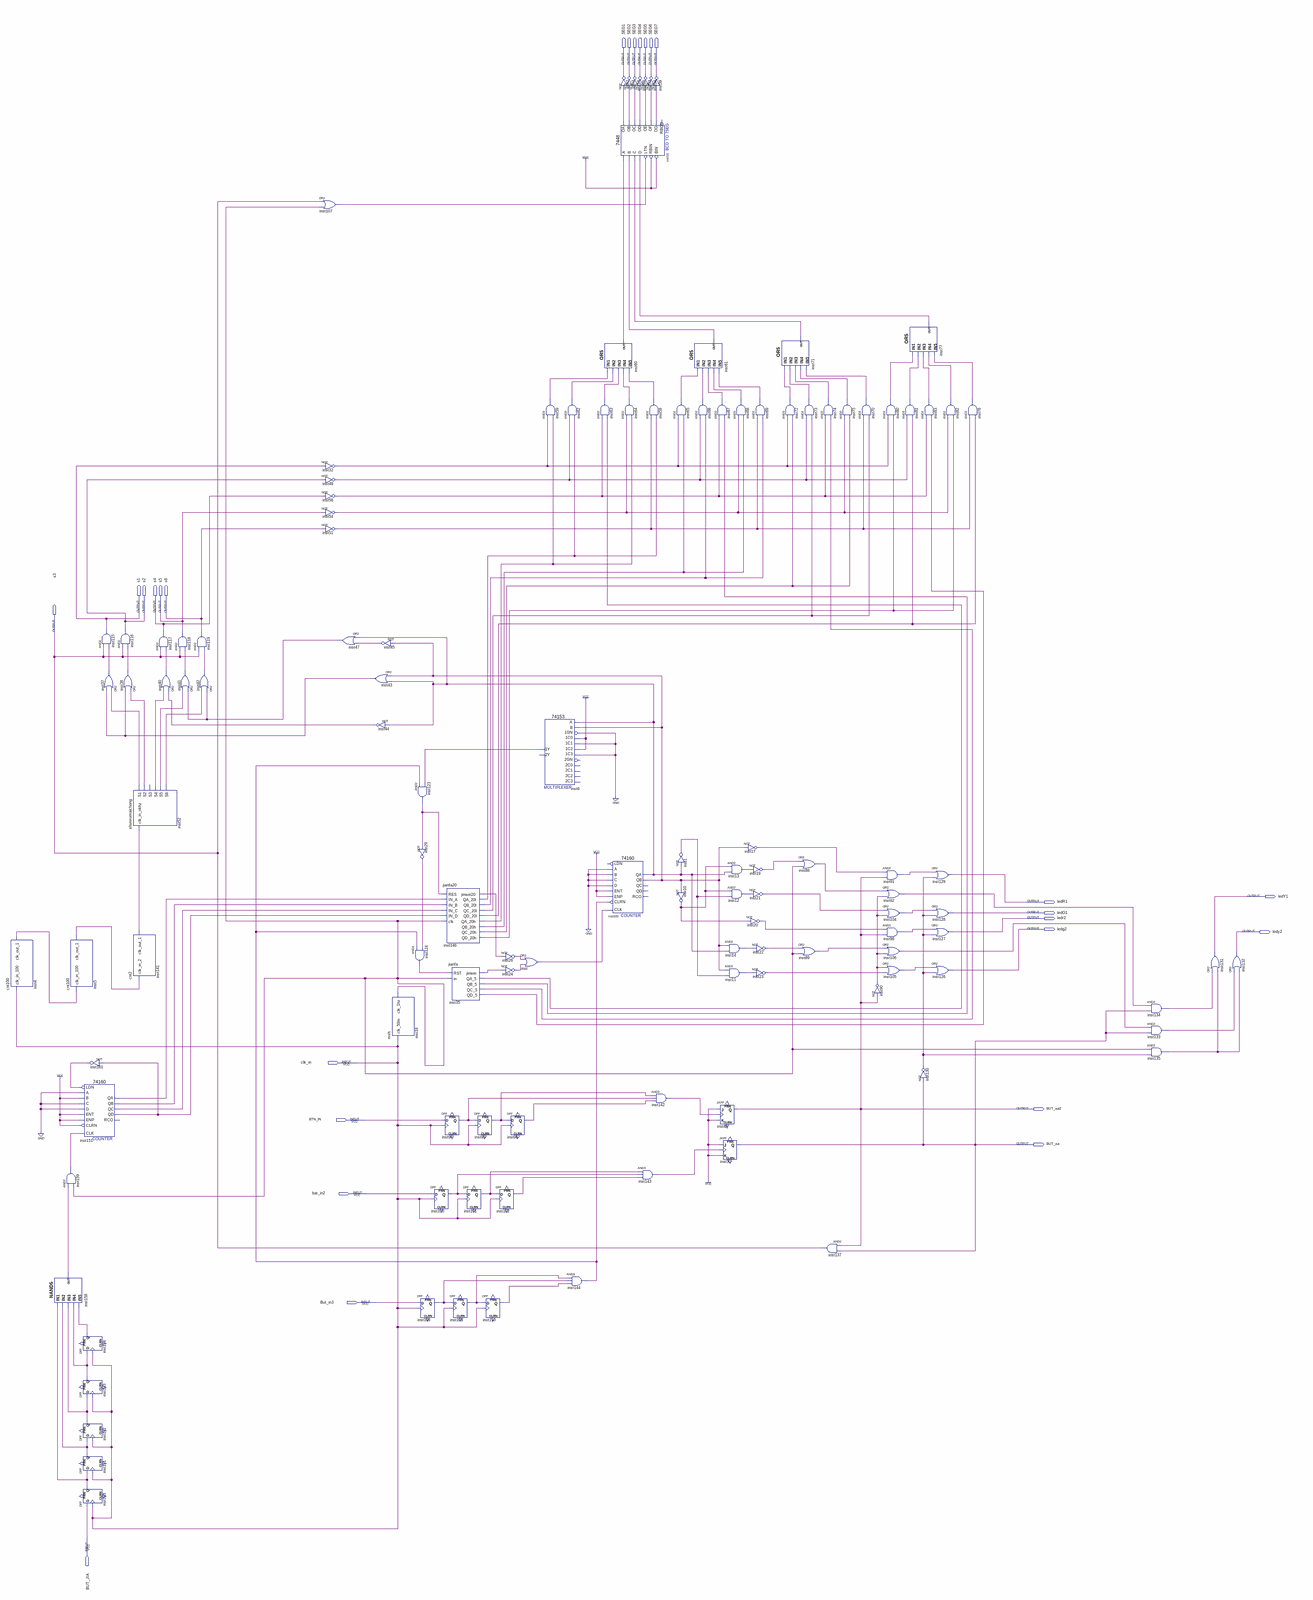
[diagram p0: schematic sheet, whole]
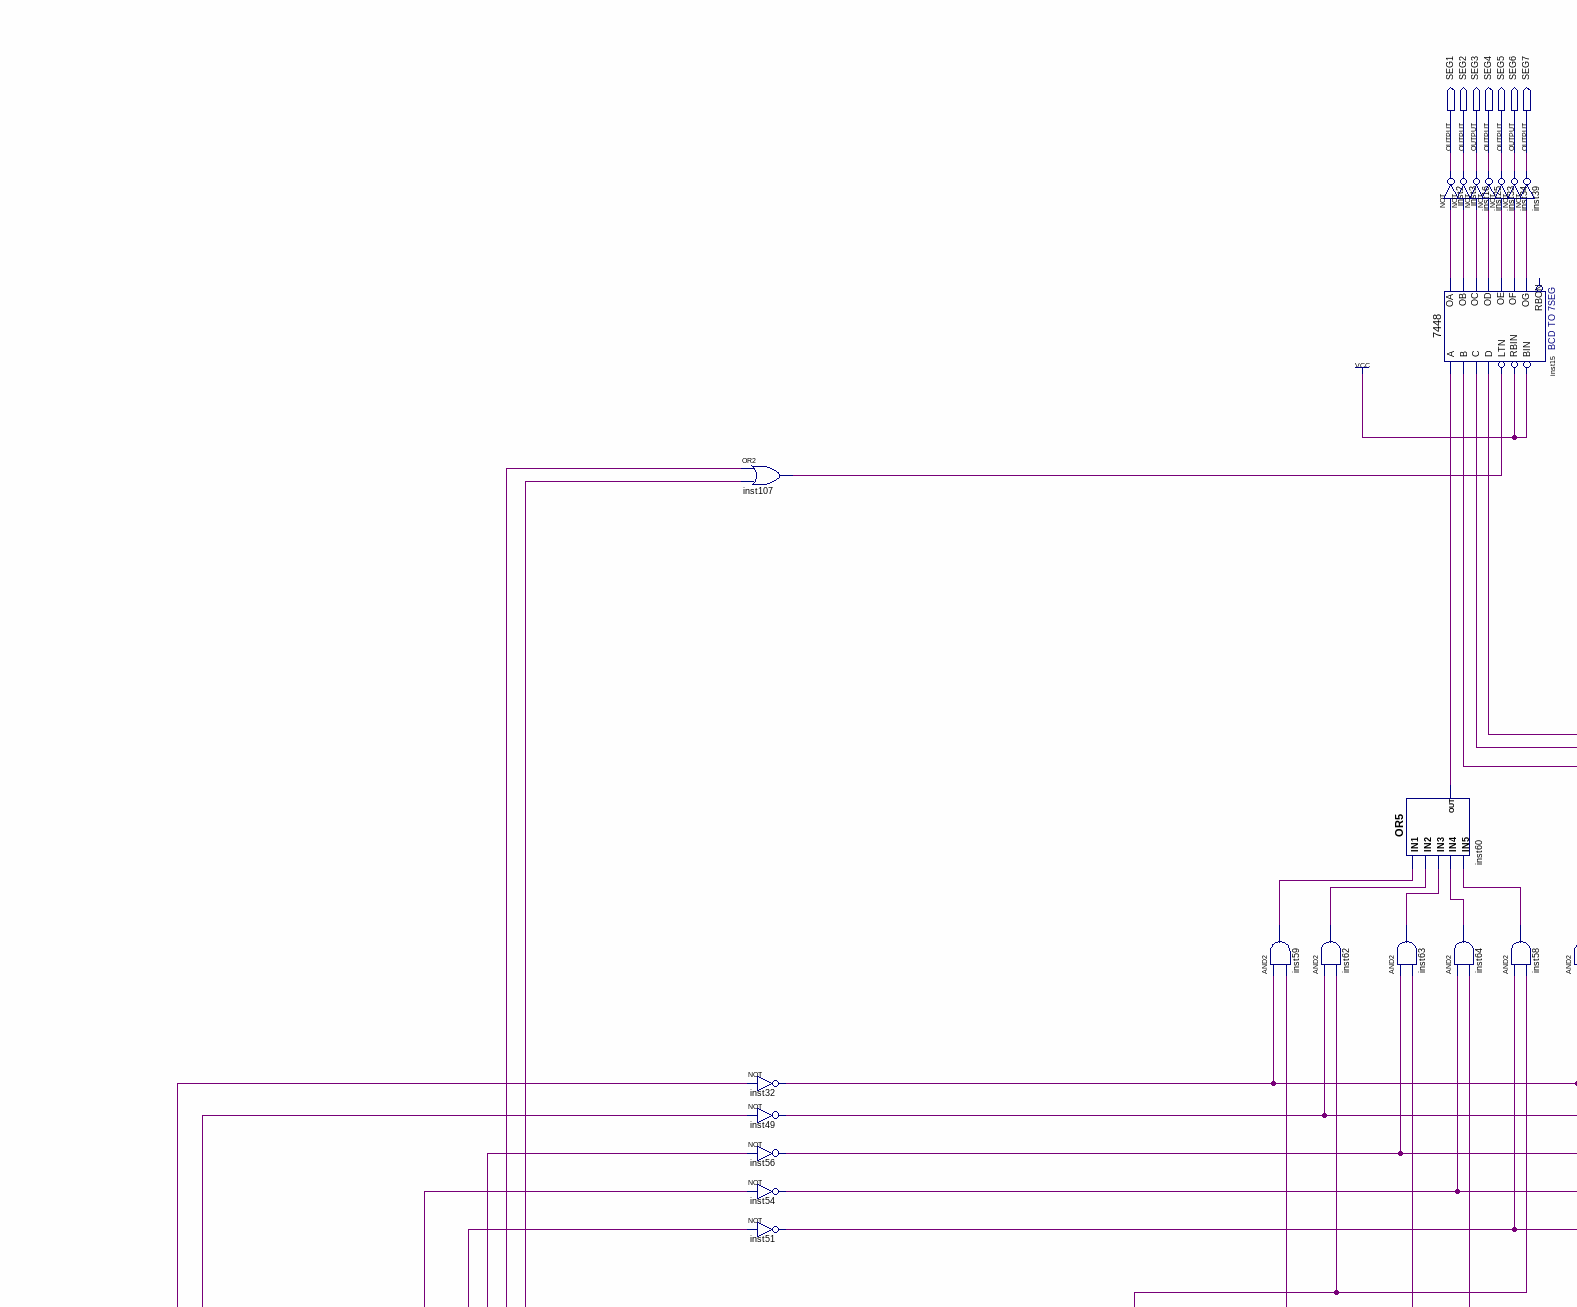
[diagram p1: schematic sheet, upper left part]
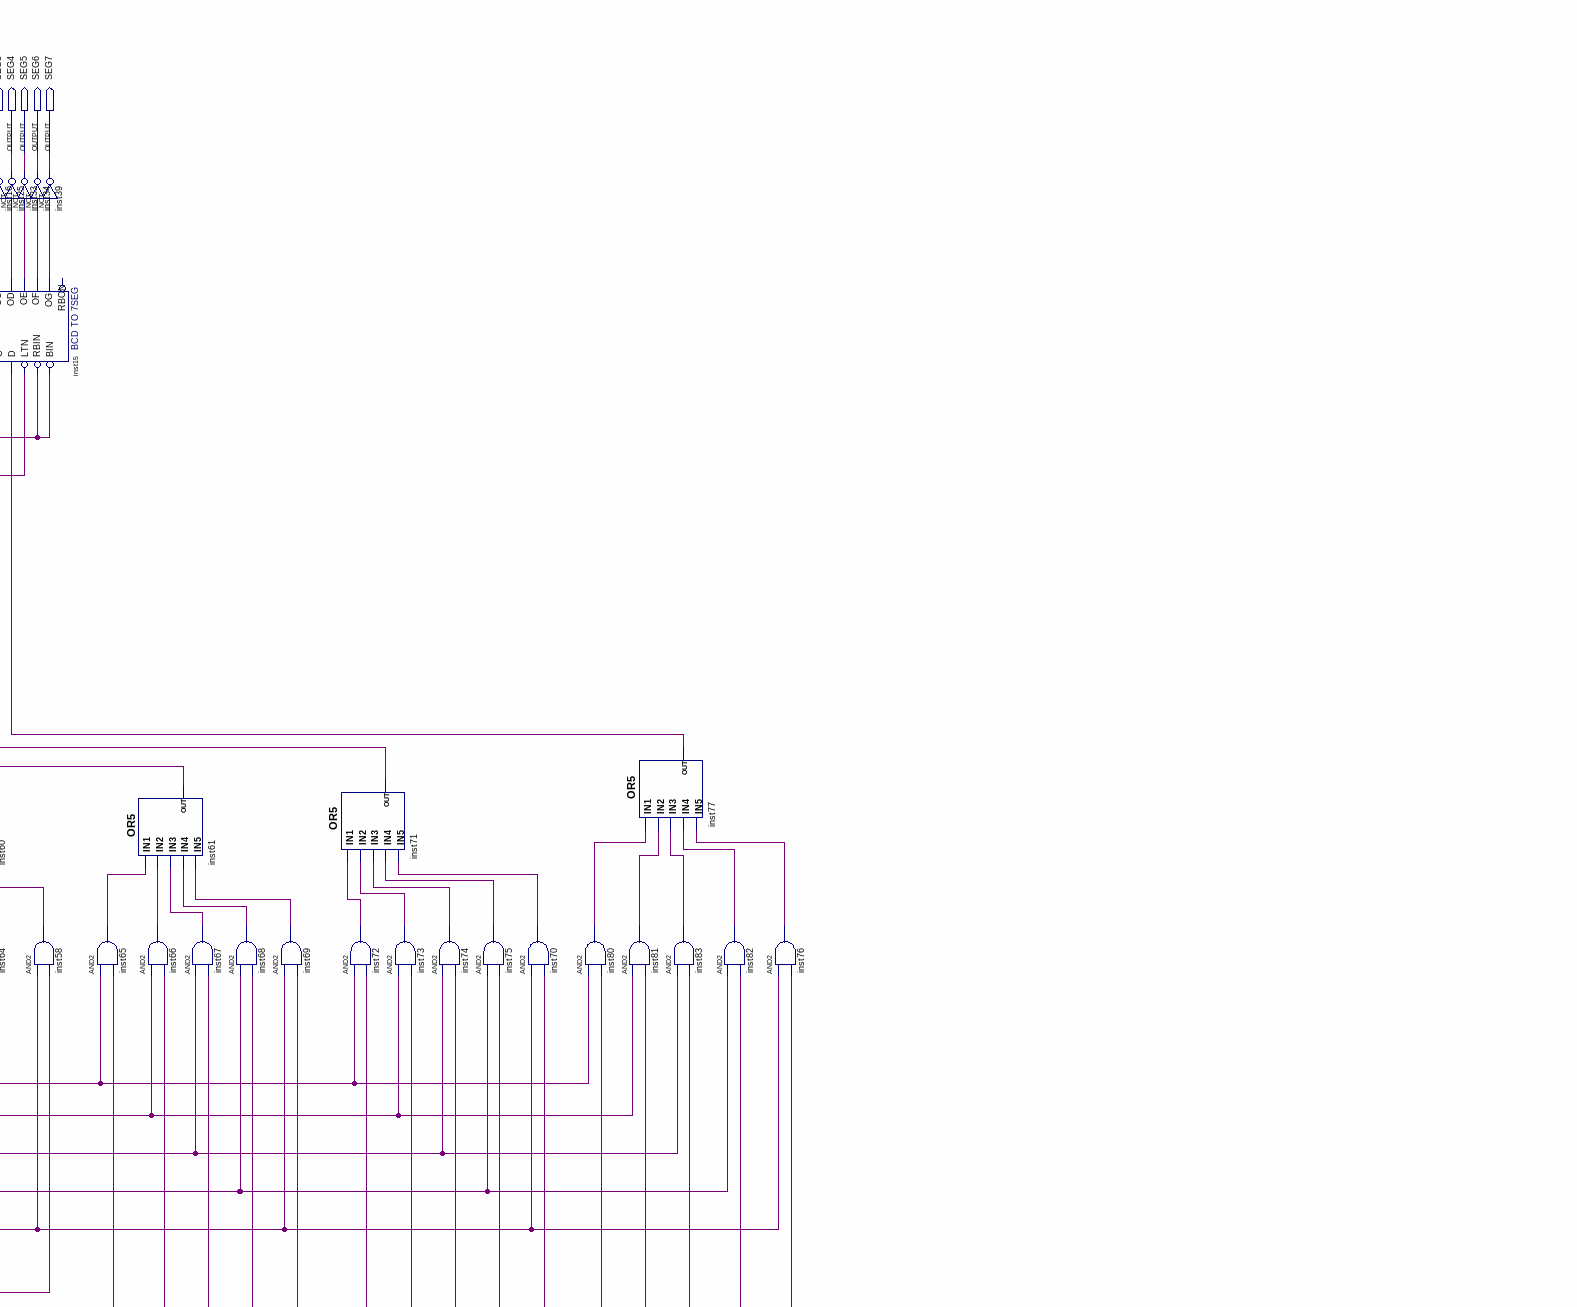
[diagram p2: schematic sheet, upper right part]
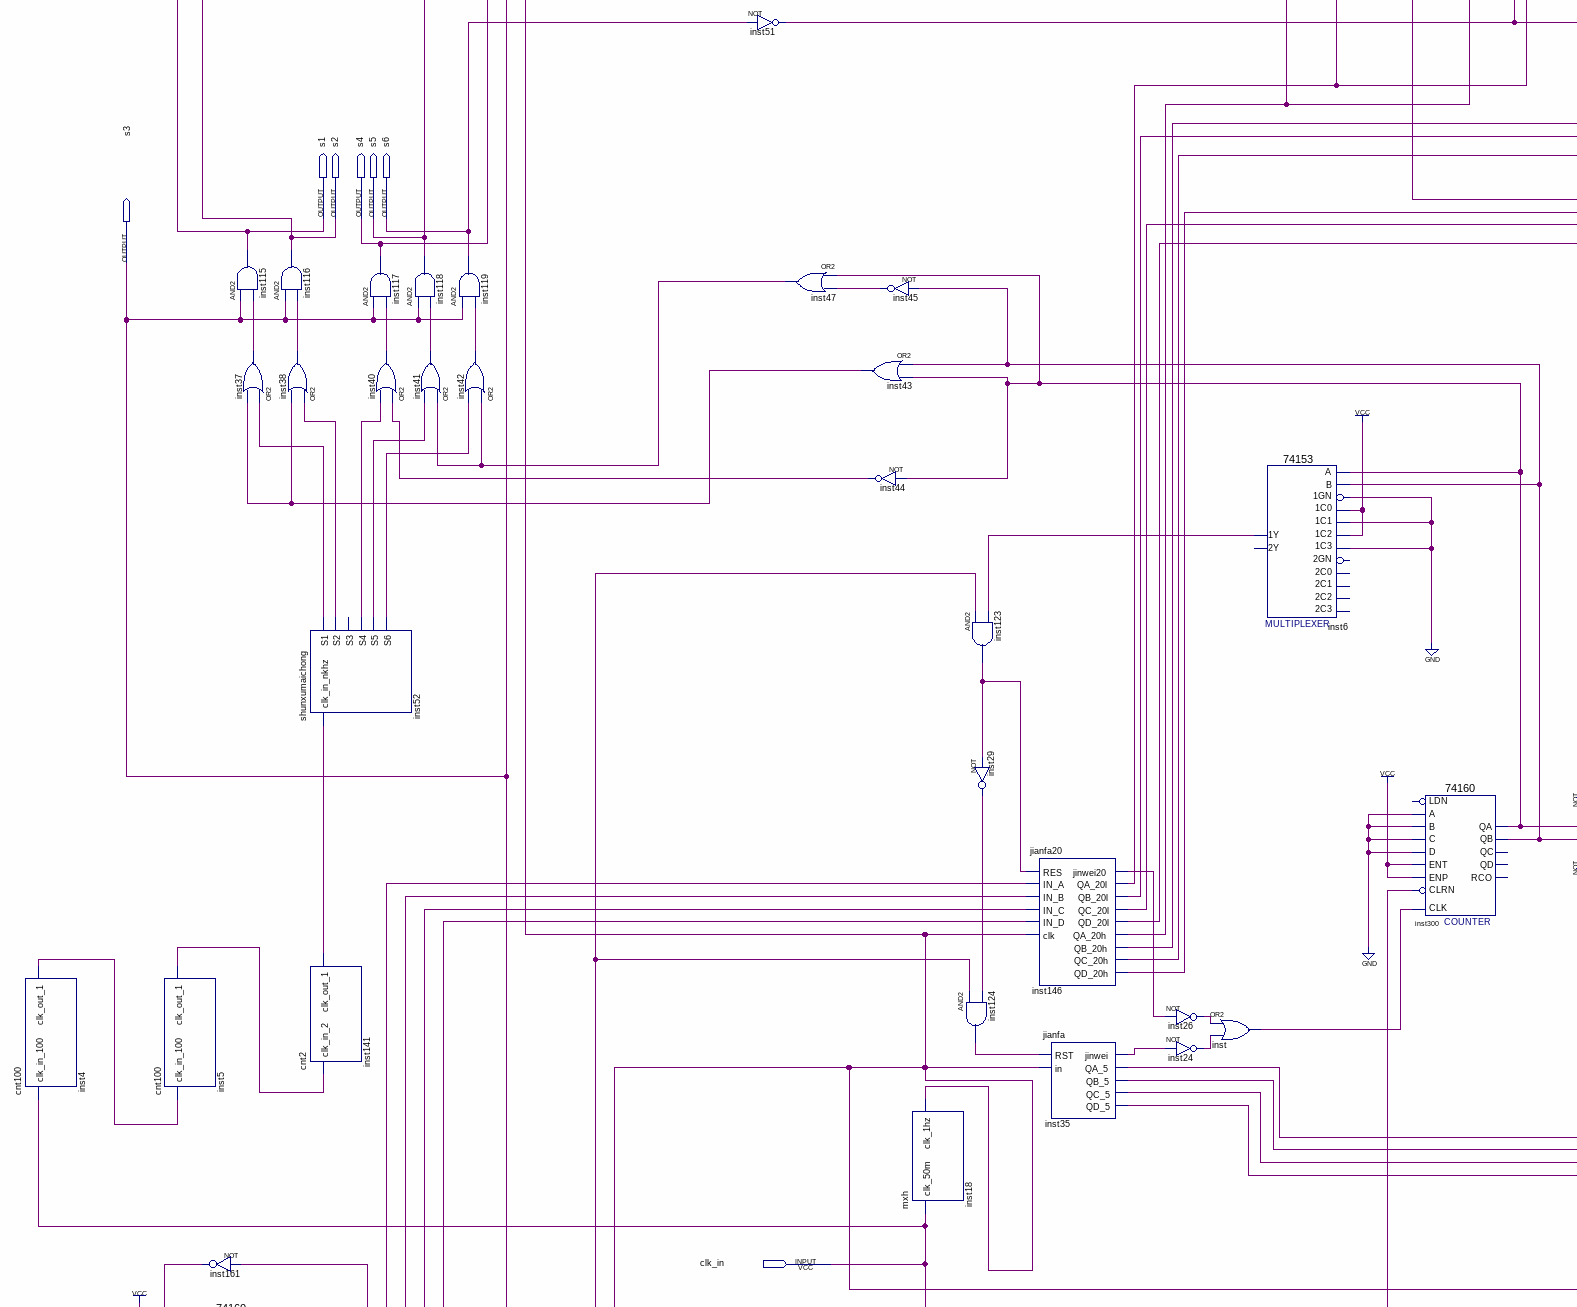
[diagram p3: schematic sheet, middle left part]
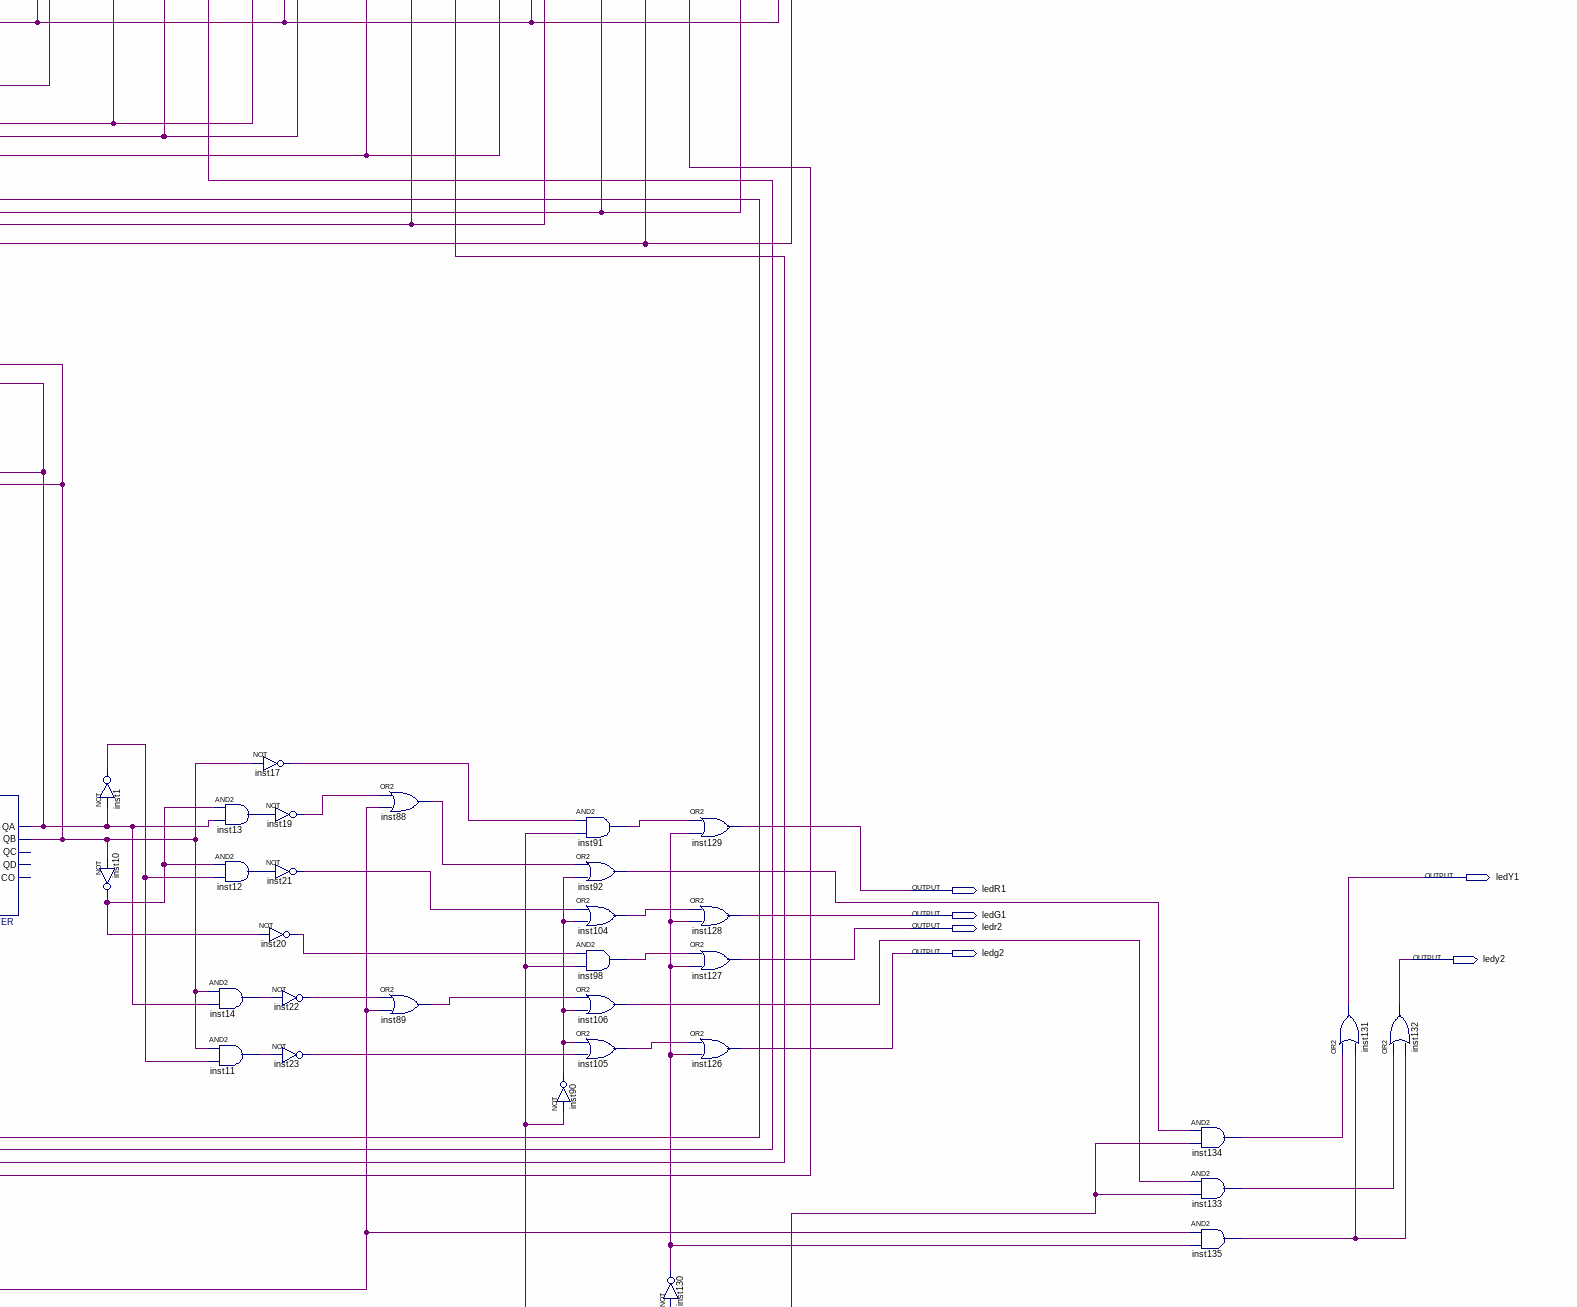
[diagram p4: schematic sheet, middle right part]
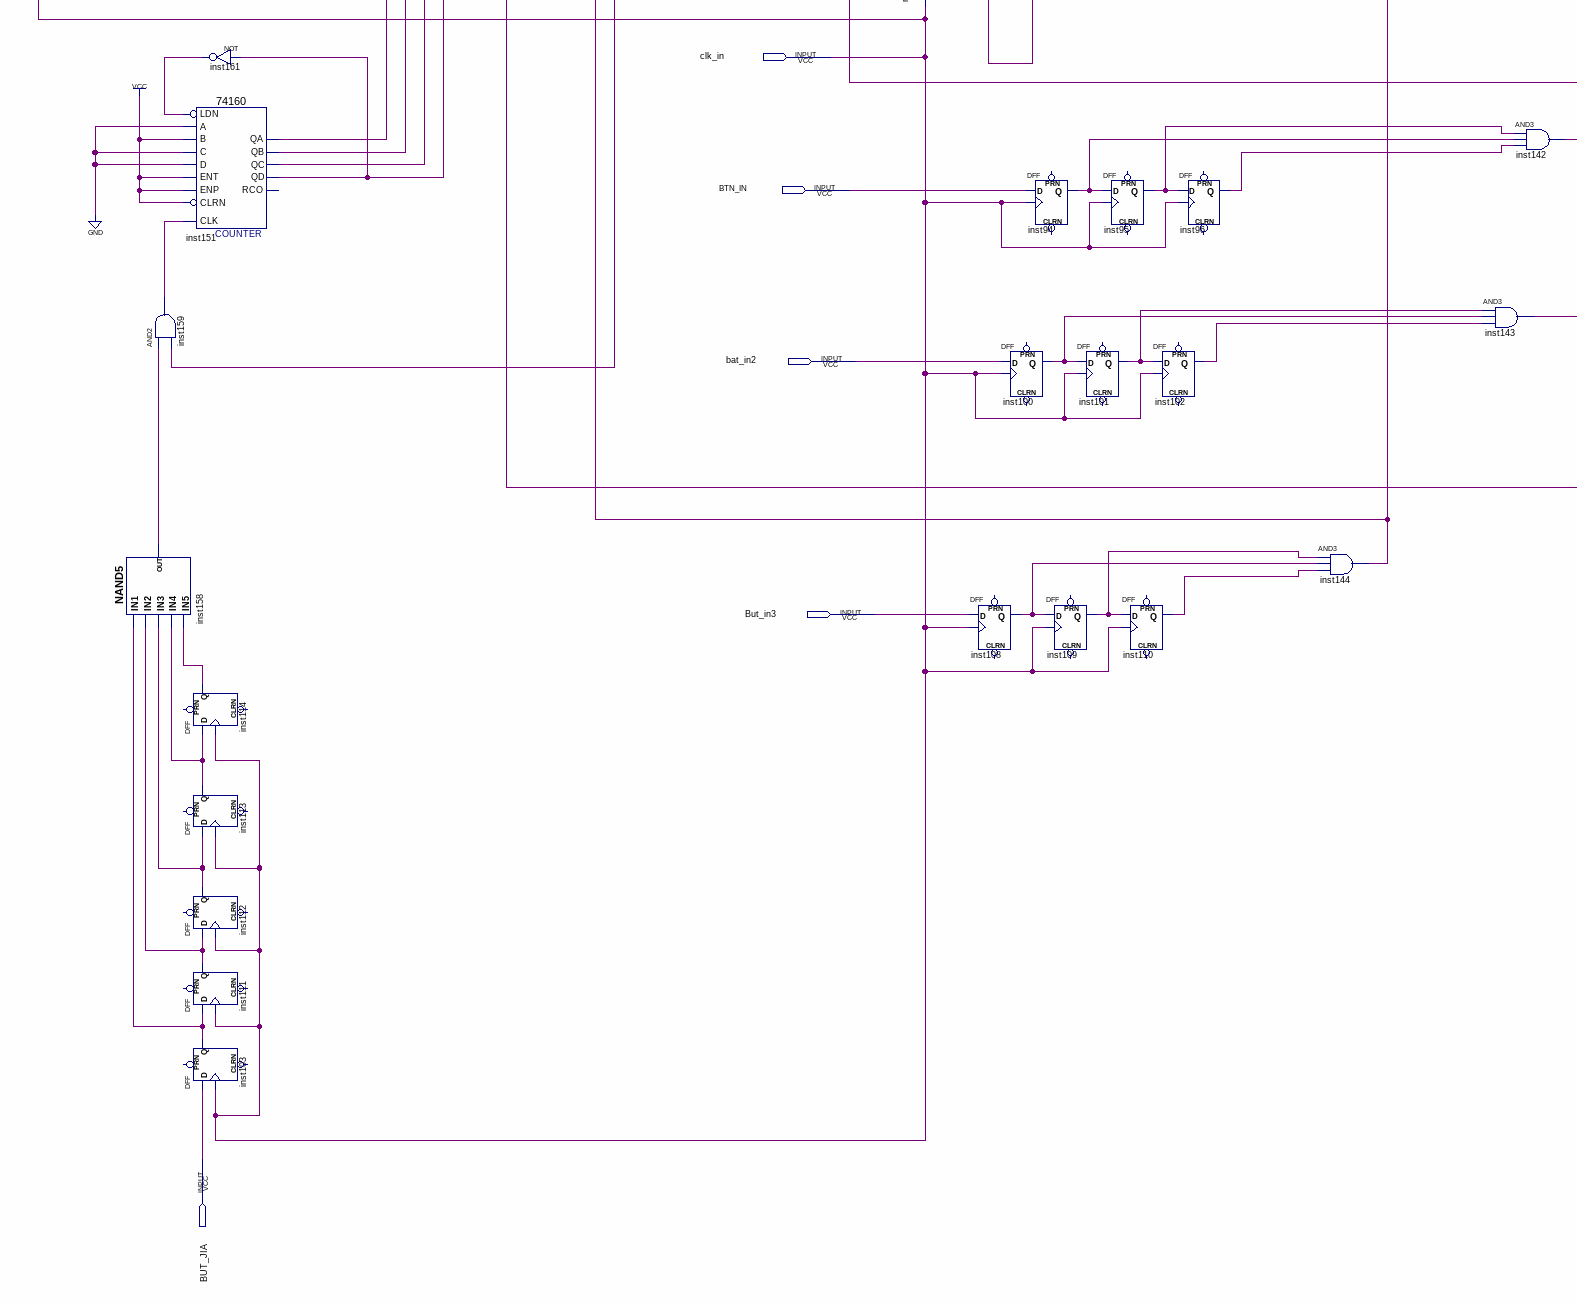
[diagram p5: schematic sheet, lower left part]
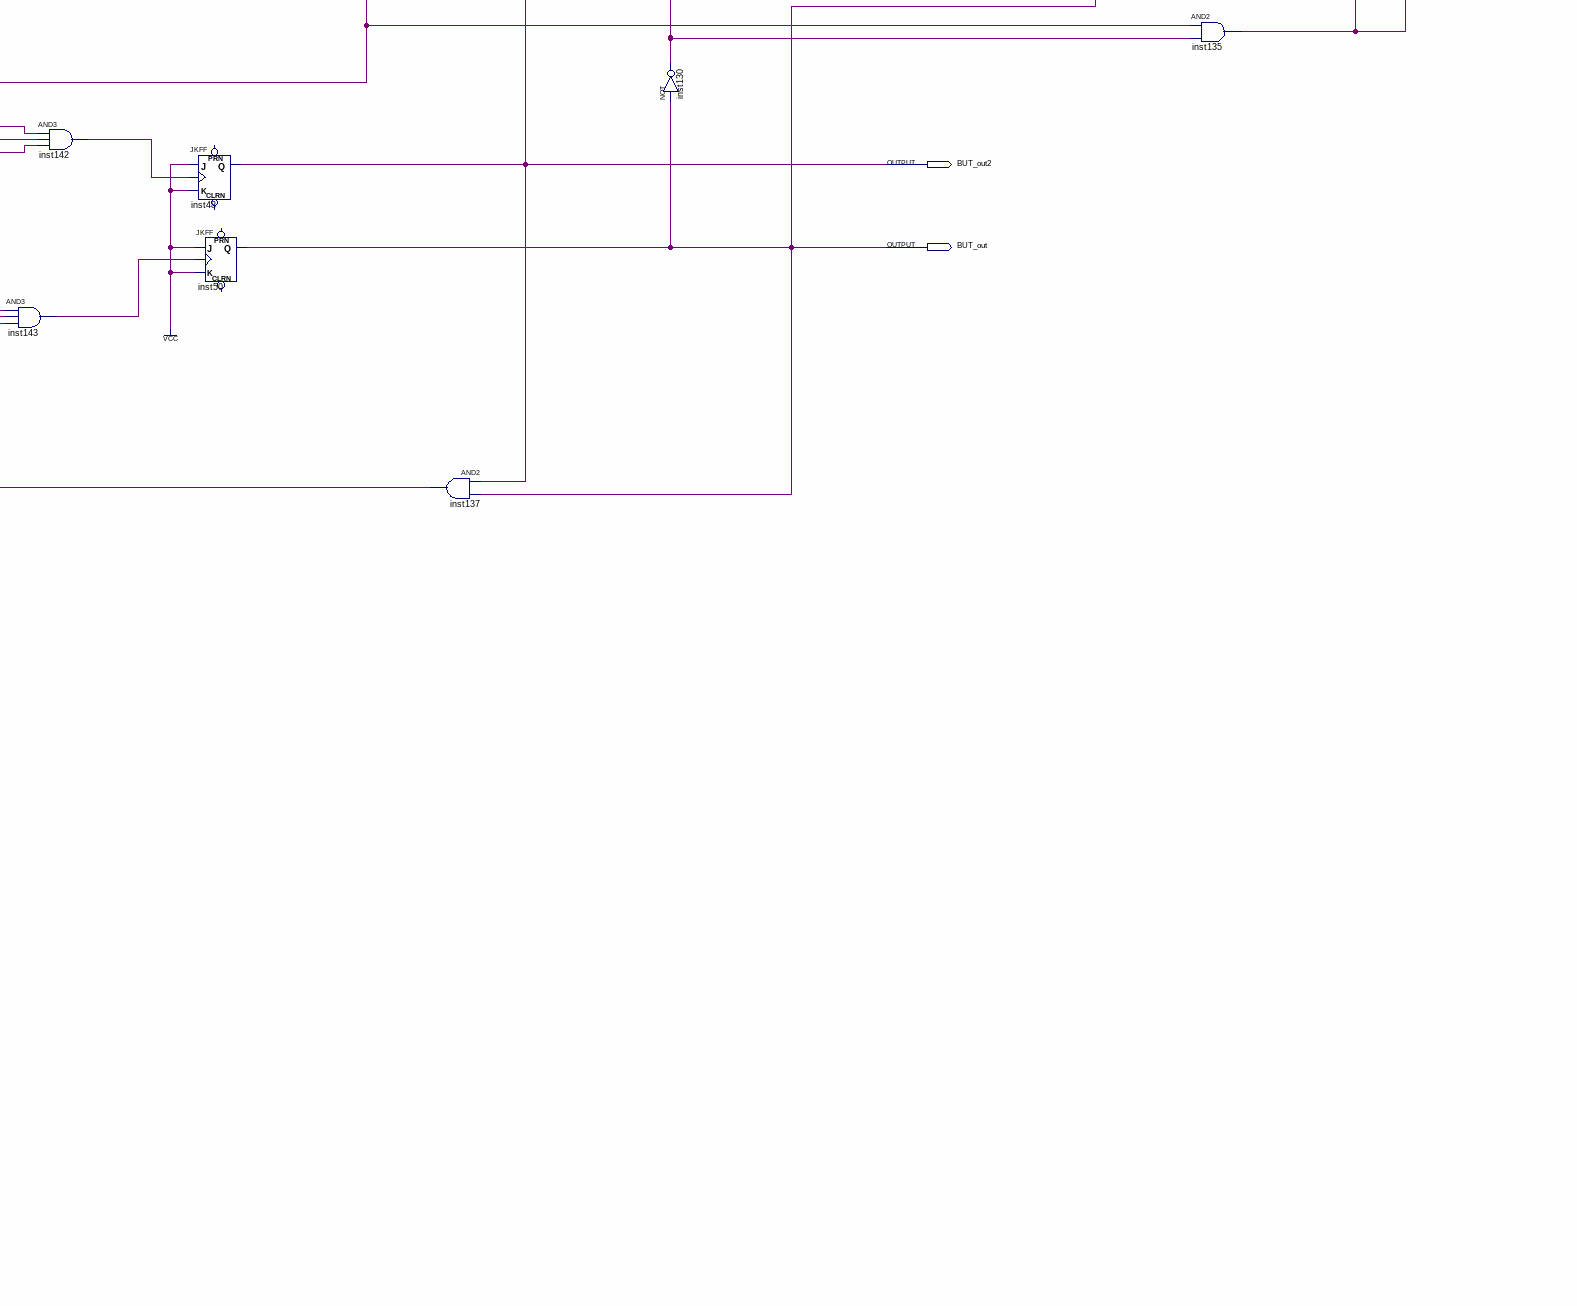
[diagram p6: schematic sheet, lower right part]
// Quartus schematic text.bdf as structural Verilog: 122 symbols, 26 pins
module text (
  input  clk_in,
  input  BTN_IN,
  input  bat_in2,
  input  But_in3,
  input  BUT_JIA,
  output SEG1,
  output SEG2,
  output SEG3,
  output SEG4,
  output SEG5,
  output SEG6,
  output SEG7,
  output s1,
  output s2,
  output s4,
  output s5,
  output s6,
  output s3,
  output ledY1,
  output ledR1,
  output ledG1,
  output ledr2,
  output ledg2,
  output ledy2,
  output BUT_out2,
  output BUT_out
);

  wire inst1_out, inst4_clk_out_1, inst5_clk_out_1, inst6_1y, inst10_out, inst11_out, inst12_out, inst13_out,
       inst14_out, inst15_oa, inst15_ob, inst15_oc, inst15_od, inst15_oe, inst15_of, inst15_og, inst17_out,
       inst18_clk_1hz, inst19_out, inst20_out, inst21_out, inst22_out, inst23_out, inst24_out, inst26_out,
       inst29_out, inst32_out, inst35_jinwei, inst35_qa_5, inst35_qb_5, inst35_qc_5, inst35_qd_5, inst37_out,
       inst38_out, inst40_out, inst41_out, inst42_out, inst43_out, inst44_out, inst45_out, inst47_out,
       inst49_out, inst51_out, inst52_s1, inst52_s2, inst52_s4, inst52_s5, inst52_s6, inst54_out, inst56_out,
       inst58_out, inst59_out, inst60_out, inst61_out, inst62_out, inst63_out, inst64_out, inst65_out,
       inst66_out, inst67_out, inst68_out, inst69_out, inst70_out, inst71_out, inst72_out, inst73_out,
       inst74_out, inst75_out, inst76_out, inst77_out, inst80_out, inst81_out, inst82_out, inst83_out,
       inst88_out, inst89_out, inst90_out, inst91_out, inst92_out, inst94_q, inst95_q, inst96_q, inst98_out,
       inst100_q, inst101_q, inst102_q, inst103_q, inst104_out, inst105_out, inst106_out, inst107_out,
       inst108_q, inst109_q, inst110_q, inst111_q, inst112_q, inst113_q, inst114_q, inst123_out, inst124_out,
       inst130_out, inst133_out, inst134_out, inst135_out, inst141_clk_out_1, inst142_out, inst143_out,
       inst144_out, inst146_jinwei20, inst146_qa_20h, inst146_qa_20l, inst146_qb_20h, inst146_qb_20l,
       inst146_qc_20h, inst146_qc_20l, inst146_qd_20h, inst146_qd_20l, inst151_qa, inst151_qb, inst151_qc,
       inst151_qd, inst158_out, inst159_out, inst161_out, inst300_qa, inst300_qb, inst_out;

  cnt100 inst4 (.clk_in_100(clk_in), .clk_out_1(inst4_clk_out_1));
  nand inst158 (inst158_out, inst103_q, inst111_q, inst112_q, inst113_q, inst114_q);
  cnt100 inst5 (.clk_in_100(inst4_clk_out_1), .clk_out_1(inst5_clk_out_1));
  and inst159 (inst159_out, inst158_out, inst18_clk_1hz);
  not inst161 (inst161_out, inst151_qd);
  \74160  inst151 (
    .CLK(inst159_out), .ENT(1'b1), .A(1'b0), .B(1'b1), .C(1'b0), .D(1'b0), .LDN(inst161_out), .ENP(1'b1),
    .CLRN(1'b1), .QD(inst151_qd), .QA(inst151_qa), .QB(inst151_qb), .QC(inst151_qc));  // open: RCO
  DFF inst114 (.CLK(clk_in), .D(inst113_q), .Q(inst114_q));  // open: CLRN, PRN
  DFF inst113 (.CLK(clk_in), .D(inst112_q), .Q(inst113_q));  // open: CLRN, PRN
  DFF inst112 (.CLK(clk_in), .D(inst111_q), .Q(inst112_q));  // open: CLRN, PRN
  DFF inst111 (.CLK(clk_in), .D(inst103_q), .Q(inst111_q));  // open: CLRN, PRN
  DFF inst103 (.CLK(clk_in), .D(BUT_JIA), .Q(inst103_q));  // open: CLRN, PRN
  and inst115 (s1, s3, inst37_out);
  or inst37 (inst37_out, inst52_s1, inst43_out);
  and inst116 (s2, s3, inst38_out);
  or inst38 (inst38_out, inst52_s2, inst43_out);
  shunxumaichong inst52 (
    .clk_in_nkhz(inst141_clk_out_1), .S1(inst52_s1), .S2(inst52_s2), .S4(inst52_s4), .S5(inst52_s5),
    .S6(inst52_s6));  // open: S3
  cnt2 inst141 (.clk_in_2(inst5_clk_out_1), .clk_out_1(inst141_clk_out_1));
  and inst117 (s4, s3, inst40_out);
  or inst40 (inst40_out, inst44_out, inst52_s4);
  and inst118 (s5, s3, inst41_out);
  or inst41 (inst41_out, inst47_out, inst52_s5);
  and inst119 (s6, s3, inst42_out);
  or inst42 (inst42_out, inst47_out, inst52_s6);
  or inst107 (inst107_out, s3, inst18_clk_1hz);
  not inst32 (inst32_out, s1);
  not inst49 (inst49_out, s2);
  not inst56 (inst56_out, s4);
  not inst54 (inst54_out, s5);
  not inst51 (inst51_out, s6);
  or inst47 (inst47_out, inst300_qa, inst45_out);
  or inst43 (inst43_out, inst300_qb, inst300_qa);
  not inst44 (inst44_out, inst300_qa);
  not inst45 (inst45_out, inst300_qb);
  mxh inst18 (.clk_50m(clk_in), .clk_1hz(inst18_clk_1hz));
  and inst123 (inst123_out, inst144_out, inst6_1y);
  not inst29 (inst29_out, inst123_out);
  and inst124 (inst124_out, inst144_out, inst29_out);
  DFF inst108 (.CLK(clk_in), .D(But_in3), .Q(inst108_q));  // open: CLRN, PRN
  jianfa20 inst146 (
    .RES(inst123_out), .IN_A(inst151_qa), .IN_B(inst151_qb), .IN_C(inst151_qc), .IN_D(inst151_qd),
    .clk(inst18_clk_1hz), .jinwei20(inst146_jinwei20), .QA_20l(inst146_qa_20l), .QB_20l(inst146_qb_20l),
    .QC_20l(inst146_qc_20l), .QD_20l(inst146_qd_20l), .QA_20h(inst146_qa_20h), .QB_20h(inst146_qb_20h),
    .QC_20h(inst146_qc_20h), .QD_20h(inst146_qd_20h));
  DFF inst94 (.CLK(clk_in), .D(BTN_IN), .Q(inst94_q));  // open: CLRN, PRN
  DFF inst100 (.CLK(clk_in), .D(bat_in2), .Q(inst100_q));  // open: CLRN, PRN
  jianfa inst35 (
    .RST(inst124_out), .in(inst18_clk_1hz), .jinwei(inst35_jinwei), .QA_5(inst35_qa_5), .QB_5(inst35_qb_5),
    .QC_5(inst35_qc_5), .QD_5(inst35_qd_5));
  DFF inst101 (.CLK(clk_in), .D(inst100_q), .Q(inst101_q));  // open: CLRN, PRN
  DFF inst109 (.CLK(clk_in), .D(inst108_q), .Q(inst109_q));  // open: CLRN, PRN
  DFF inst95 (.CLK(clk_in), .D(inst94_q), .Q(inst95_q));  // open: CLRN, PRN
  DFF inst110 (.CLK(clk_in), .D(inst109_q), .Q(inst110_q));  // open: CLRN, PRN
  not inst26 (inst26_out, inst146_jinwei20);
  not inst24 (inst24_out, inst35_jinwei);
  DFF inst96 (.CLK(clk_in), .D(inst95_q), .Q(inst96_q));  // open: CLRN, PRN
  DFF inst102 (.CLK(clk_in), .D(inst101_q), .Q(inst102_q));  // open: CLRN, PRN
  or inst (inst_out, inst26_out, inst24_out);
  and inst59 (inst59_out, inst32_out, inst146_qa_20h);
  \74153  inst6 (
    .\1C1 (1'b0), .\1GN (1'b0), .\1C0 (1'b1), .\1C2 (1'b1), .\1C3 (1'b0), .B(inst300_qb), .A(inst300_qa),
    .\1Y (inst6_1y));  // open: 2C0, 2GN, 2C2, 2C1, 2C3, 2Y
  and inst62 (inst62_out, inst49_out, inst146_qa_20l);
  and inst144 (inst144_out, inst109_q, inst108_q, inst110_q);
  \7448  inst15 (
    .A(inst60_out), .C(inst71_out), .D(inst77_out), .B(inst61_out), .RBIN(1'b1), .BIN(1'b1),
    .LTN(inst107_out), .OC(inst15_oc), .OE(inst15_oe), .OD(inst15_od), .OF(inst15_of), .OG(inst15_og),
    .OB(inst15_ob), .OA(inst15_oa));  // open: RBON
  or inst60 (inst60_out, inst59_out, inst62_out, inst63_out, inst64_out, inst58_out);
  and inst63 (inst63_out, inst56_out, inst35_qa_5);
  \74160  inst300 (
    .CLK(inst_out), .ENT(1'b1), .A(1'b0), .B(1'b0), .C(1'b0), .D(1'b0), .ENP(1'b1), .CLRN(inst144_out),
    .QA(inst300_qa), .QB(inst300_qb));  // open: LDN, QD, QC, RCO
  not inst2 (SEG1, inst15_oa);
  not inst3 (SEG2, inst15_ob);
  not inst16 (SEG3, inst15_oc);
  not inst25 (SEG4, inst15_od);
  and inst64 (inst64_out, inst54_out, inst146_qa_20h);
  and inst143 (inst143_out, inst101_q, inst100_q, inst102_q);
  not inst33 (SEG5, inst15_oe);
  not inst34 (SEG6, inst15_of);
  not inst39 (SEG7, inst15_og);
  and inst58 (inst58_out, inst51_out, inst146_qa_20l);
  and inst142 (inst142_out, inst95_q, inst94_q, inst96_q);
  and inst65 (inst65_out, inst32_out, inst146_qb_20h);
  not inst1 (inst1_out, inst300_qa);
  not inst10 (inst10_out, inst300_qb);
  or inst61 (inst61_out, inst65_out, inst66_out, inst67_out, inst68_out, inst69_out);
  and inst66 (inst66_out, inst49_out, inst146_qb_20l);
  and inst67 (inst67_out, inst56_out, inst35_qb_5);
  and inst14 (inst14_out, inst300_qb, inst300_qa);
  and inst11 (inst11_out, inst300_qb, inst1_out);
  JKFF inst48 (.K(1'b1), .J(1'b1), .CLK(inst142_out), .Q(BUT_out2));  // open: PRN, CLRN
  JKFF inst50 (.K(1'b1), .J(1'b1), .CLK(inst143_out), .Q(BUT_out));  // open: PRN, CLRN
  and inst68 (inst68_out, inst54_out, inst146_qb_20h);
  not inst17 (inst17_out, inst300_qb);
  and inst13 (inst13_out, inst10_out, inst300_qa);
  and inst12 (inst12_out, inst10_out, inst1_out);
  not inst20 (inst20_out, inst10_out);
  and inst69 (inst69_out, inst51_out, inst146_qb_20l);
  not inst19 (inst19_out, inst13_out);
  not inst21 (inst21_out, inst12_out);
  not inst22 (inst22_out, inst14_out);
  not inst23 (inst23_out, inst11_out);
  or inst71 (inst71_out, inst72_out, inst73_out, inst74_out, inst75_out, inst70_out);
  and inst72 (inst72_out, inst32_out, inst146_qc_20h);
  and inst73 (inst73_out, inst49_out, inst146_qc_20l);
  or inst88 (inst88_out, inst19_out, inst18_clk_1hz);
  or inst89 (inst89_out, inst22_out, inst18_clk_1hz);
  and inst74 (inst74_out, inst56_out, inst35_qc_5);
  and inst137 (s3, BUT_out2, BUT_out);
  and inst75 (inst75_out, inst54_out, inst146_qc_20h);
  and inst70 (inst70_out, inst51_out, inst146_qc_20l);
  not inst90 (inst90_out, BUT_out2);
  and inst80 (inst80_out, inst32_out, inst146_qd_20h);
  and inst91 (inst91_out, inst17_out, BUT_out2);
  or inst92 (inst92_out, inst88_out, inst90_out);
  or inst104 (inst104_out, inst21_out, inst90_out);
  and inst98 (inst98_out, inst20_out, BUT_out2);
  or inst106 (inst106_out, inst89_out, inst90_out);
  or inst105 (inst105_out, inst90_out, inst23_out);
  or inst77 (inst77_out, inst80_out, inst81_out, inst83_out, inst82_out, inst76_out);
  and inst81 (inst81_out, inst49_out, inst146_qd_20l);
  and inst83 (inst83_out, inst56_out, inst35_qd_5);
  not inst130 (inst130_out, BUT_out);
  and inst82 (inst82_out, inst54_out, inst146_qd_20h);
  or inst129 (ledR1, inst91_out, inst130_out);
  or inst128 (ledG1, inst104_out, inst130_out);
  or inst127 (ledr2, inst98_out, inst130_out);
  or inst126 (ledg2, inst105_out, inst130_out);
  and inst76 (inst76_out, inst51_out, inst146_qd_20l);
  and inst134 (inst134_out, inst92_out, BUT_out);
  and inst133 (inst133_out, inst106_out, BUT_out);
  and inst135 (inst135_out, inst18_clk_1hz, inst130_out);
  or inst131 (ledY1, inst134_out, inst135_out);
  or inst132 (ledy2, inst133_out, inst135_out);
endmodule
